# EAGLE design Platypus_v2_0_Proto_v1_0 (EAGLE 7.5.0)
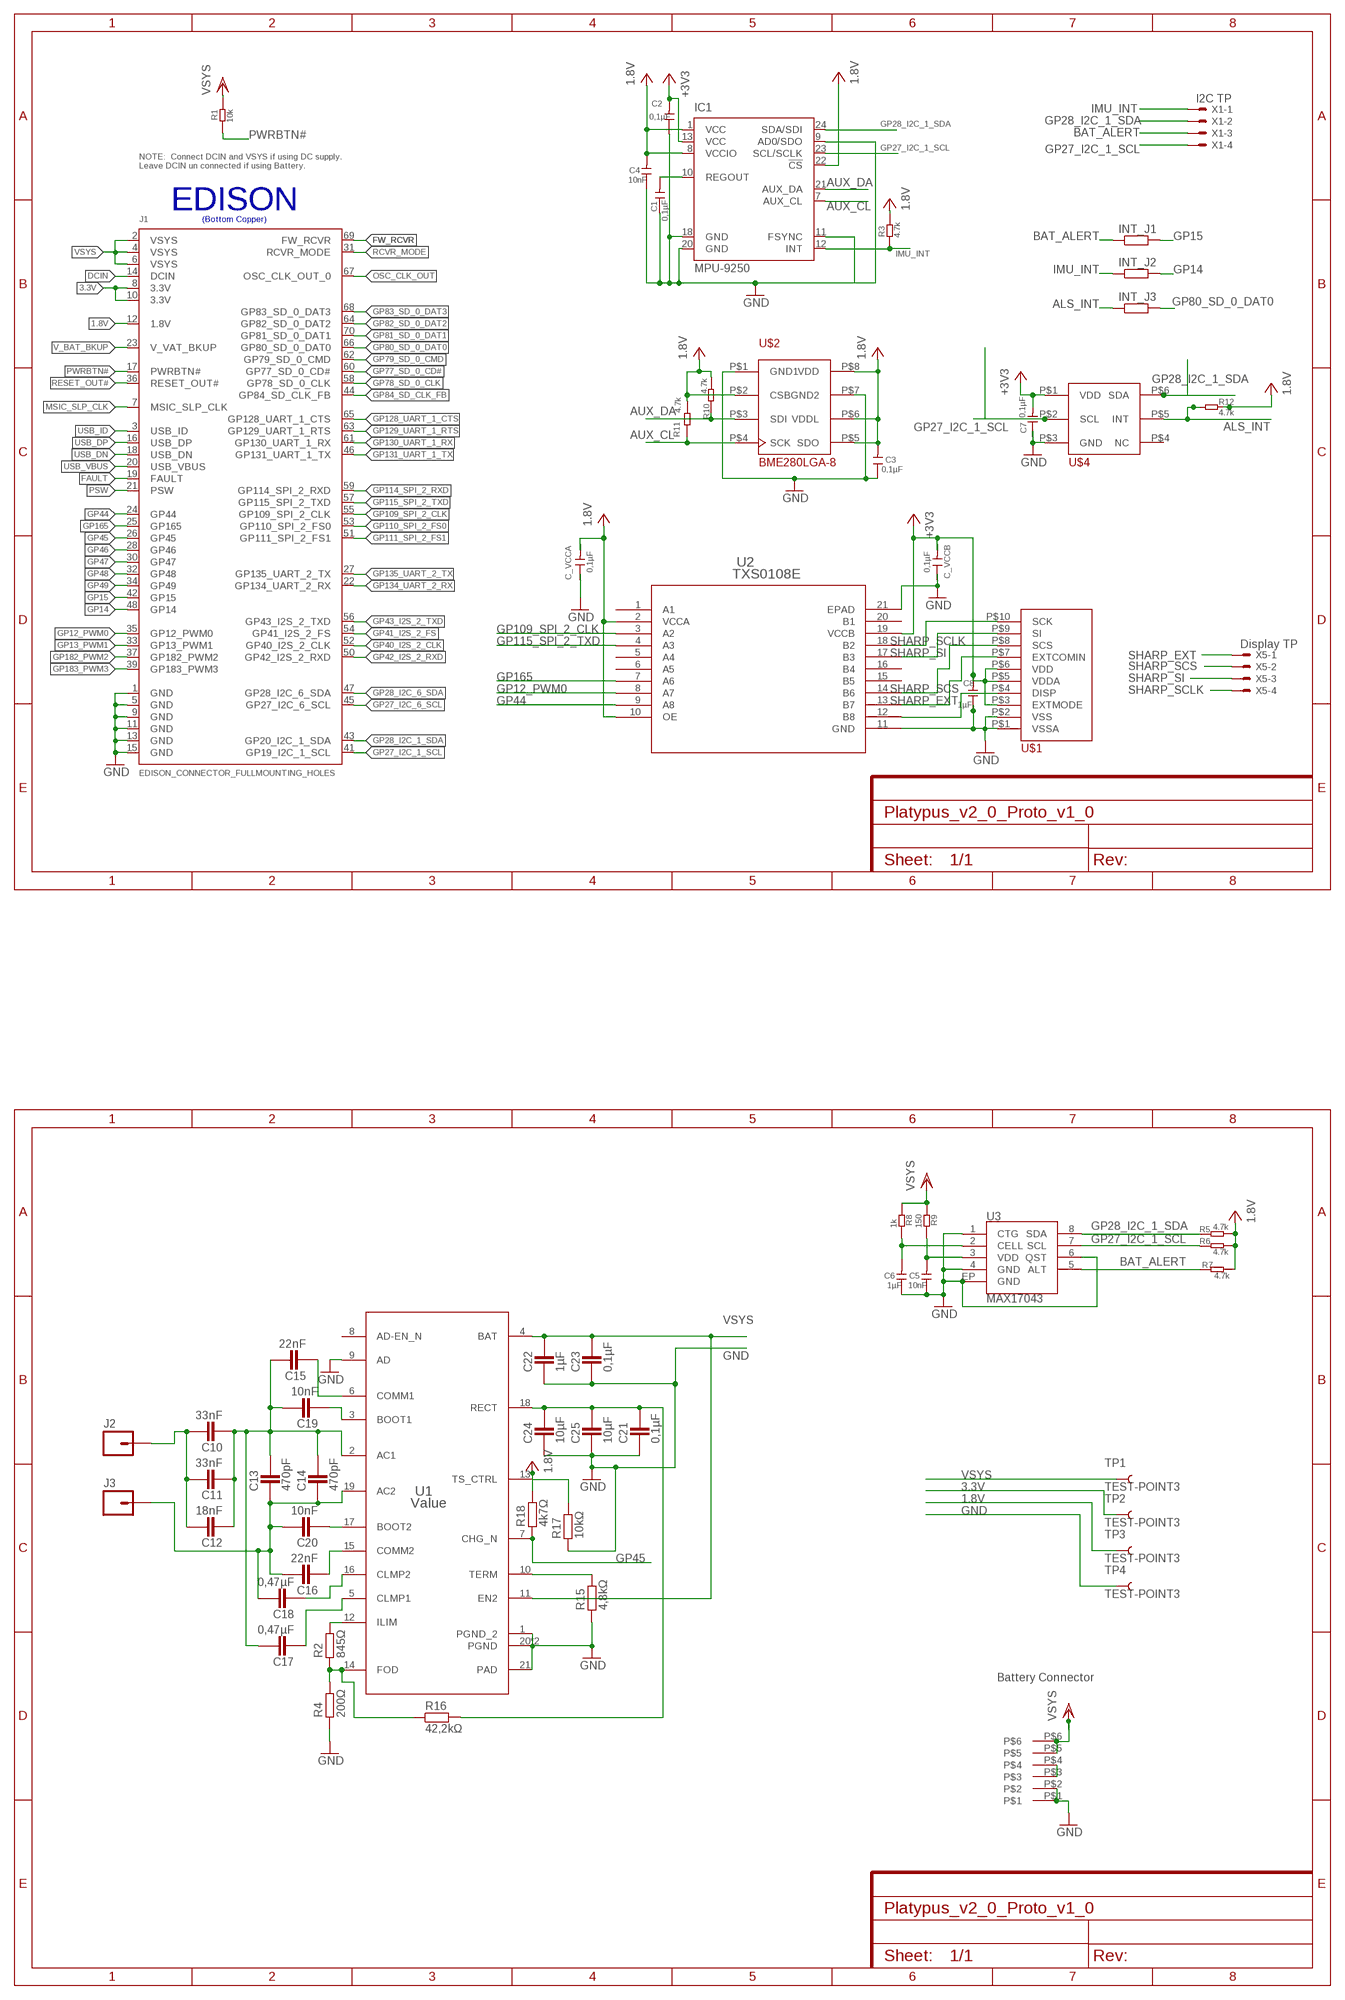
[diagram p0: schematic, sheet 1]

## Parts
C1  0,1µF  C-0603  [C0603]
C2  0,1µF  C-0603  [C0603]
C3  0,1µF  C-0603  [C0603]
C4  10nF  C-0603  [C0603]
C5  10nF  C-0603  [C0603]
C6  1µF  C-0603  [C0603]
C7  0,1µF  C-0603  [C0603]
C8  1µF  C-0603  [C0603]
C10  33nF  CAPACITOR_0402  [CAPC1005X60N]
C11  33nF  CAPACITOR_0402  [CAPC1005X60N]
C12  18nF  CAPACITOR_0402  [CAPC1005X60N]
C13  470pF  CAPACITOR_0402  [CAPC1005X60N]
C14  470pF  CAPACITOR_0402  [CAPC1005X60N]
C15  22nF  CAPACITOR_0402  [CAPC1005X60N]
C16  22nF  CAPACITOR_0402  [CAPC1005X60N]
C17  0,47µF  CAPACITOR_0402  [CAPC1005X60N]
C18  0,47µF  CAPACITOR_0402  [CAPC1005X60N]
C19  10nF  CAPACITOR_0402  [CAPC1005X60N]
C20  10nF  CAPACITOR_0402  [CAPC1005X60N]
C21  0,1µF  CAPACITOR_0402  [CAPC1005X60N]
C22  1µF  CAPACITOR_0402  [CAPC1005X60N]
C23  0,1µF  CAPACITOR_0402  [CAPC1005X60N]
C24  10µF  CAPACITOR_0603  [CAPC1608X92N]
C25  10µF  CAPACITOR_0603  [CAPC1608X92N]
C_VCCA  0,1µF  C-0603  [C0603]
C_VCCB  0,1µF  C-0603  [C0603]
IC1  MPU-9250  [QFN24-SMALL]
INT_J1  R-EU_R0201  [R0201]
INT_J2  R-EU_R0201  [R0201]
INT_J3  R-EU_R0201  [R0201]
J1  EDISON_CONNECTOR_FULLMOUNTING_HOLES  [EDISON_DAUGHTER]
J2  M01NOSILK-KIT  [1X01NS-KIT]
J3  M01NOSILK-KIT  [1X01NS-KIT]
R1  10k  R-0603  [R0603]
R2  845Ω  RESISTOR_0402  [RESC1005X40AN]
R3  4.7k  R-0603  [R0603]
R4  200Ω  RESISTOR_0402  [RESC1005X40AN]
R5  4.7k  R-0603  [R0603]
R6  4.7k  R-0603  [R0603]
R7  4.7k  R-0603  [R0603]
R8  1k  R-0603  [R0603]
R9  150  R-0603  [R0603]
R10  4.7k  R-0603  [R0603]
R11  4.7k  R-0603  [R0603]
R12  4.7k  R-0603  [R0603]
R15  4,8kΩ  RESISTOR_0402  [RESC1005X40AN]
R16  42,2kΩ  RESISTOR_0402  [RESC1005X40AN]
R17  10kΩ  RESISTOR_0402  [RESC1005X40AN]
R18  4k7Ω  RESISTOR_0402  [RESC1005X40AN]
TP1  TEST-POINT3  [PAD.03X.03]
TP2  TEST-POINT3  [PAD.03X.03]
TP3  TEST-POINT3  [PAD.03X.03]
TP4  TEST-POINT3  [PAD.03X.03]
U1  Value  BQ51050BRHLR  [RHL0020A]
U2  TXS0108E  TXS0108E_RGY_20  [RGY20_3P05X2P05]
U3  MAX17043  MAX1704X  [TDFN-8]
U$1  FH34SRJ-10S-0.5SH(50)FRC-10PIN-0.5MM  [FRC-10PIN-0.5MM]
U$2  BME280LGA-8  [LGA-8]
U$3  HIROSE_BAT_CON  [0.5MM-PITCH,6-PIN]
U$4  TSL25723FNFN-6PIN  [FN-6PIN]
X1  I2C TP  53047-04  [53047-04]
X5  Display TP  53047-04  [53047-04]

## Nets
1.8V: C3.2 C4.2 C_VCCA.2 IC1.1(VCC) IC1.8(VCCIO) IC1.22(!CS) J1.12(1.8V) R3.2 R5.2 R6.2 R7.1 R10.2 R11.2 R12.2 R18.2 TP3.P$1 U2.2(VCCA) U2.10(OE) U$2.P$2(CSB) U$2.P$5(SDO) U$2.P$6(VDDL) U$2.P$8(VDD)
3.3V: C2.2 C7.2 IC1.13(VCC) J1.8(3.3V) J1.10(3.3V) TP2.P$1 U$4.P$1(VDD) ; supply symbol labelled +3V3
+3V3: C8.2 C_VCCB.2 U2.19(VCCB) U$1.P$3(EXTMODE) U$1.P$5(VDDA) U$1.P$6(VDD)
ALS_INT: INT_J3.1 R12.1 U$4.P$5(INT)
AUX_CL: IC1.7(AUX_CL) R11.1 U$2.P$4(SCK)
AUX_DA: IC1.21(AUX_DA) R10.1 U$2.P$3(SDI)
BAT_ALERT: INT_J1.1 R7.2 U3.5(ALT) X1.3
DCIN: J1.14(DCIN)
FAULT: J1.19(FAULT)
FW_RCVR: J1.69(FW_RCVR)
GND: C1.1 C2.1 C3.1 C4.1 C5.1 C6.1 C7.1 C8.1 C21.1 C22.1 C23.1 C24.1 C25.1 C_VCCA.1 C_VCCB.1 IC1.9(AD0/SDO) IC1.11(FSYNC) IC1.18(GND) IC1.20(GND) J1.1(GND) J1.5(GND) J1.9(GND) J1.11(GND) J1.13(GND) J1.15(GND) R4.1 R15.1 R17.1 TP4.P$1 U1.1(PGND_2) U1.9(AD) U1.20(PGND) U1.21(PAD) U1.P$1(PGND) U2.11(GND) U2.21(EPAD) U3.1(CTG) U3.4(GND) U3.6(QST) U3.EP(GND) U$1.P$1(VSSA) U$1.P$2(VSS) U$2.P$1(GND1) U$2.P$7(GND2) U$3.P$1 U$3.P$2 U$4.P$3(GND)
GP12_PWM0: J1.35(GP12_PWM0) U2.8(A7)
GP13_PWM1: J1.33(GP13_PWM1)
GP14: INT_J2.2 J1.48(GP14)
GP15: INT_J1.2 J1.42(GP15)
GP27_I2C_1_SCL: IC1.23(SCL/SCLK) J1.41(GP19_I2C_1_SCL) R6.1 U3.7(SCL) U$4.P$2(SCL) X1.4
GP27_I2C_6_SCL: J1.45(GP27_I2C_6_SCL)
GP28_I2C_1_SDA: IC1.24(SDA/SDI) J1.43(GP20_I2C_1_SDA) R5.1 U3.8(SDA) U$4.P$6(SDA) X1.2
GP28_I2C_6_SDA: J1.47(GP28_I2C_6_SDA)
GP40_I2S_2_CLK: J1.52(GP40_I2S_2_CLK)
GP41_I2S_2_FS: J1.54(GP41_I2S_2_FS)
GP42_I2S_2_RXD: J1.50(GP42_I2S_2_RXD)
GP43_I2S_2_TXD: J1.56(GP43_I2S_2_TXD)
GP44: J1.24(GP44) U2.9(A8)
GP45: J1.26(GP45) R18.1 U1.7(CHG_N)
GP46: J1.28(GP46)
GP47: J1.30(GP47)
GP48: J1.32(GP48)
GP49: J1.34(GP49)
GP77_SD_0_CD#: J1.60(GP77_SD_0_CD#)
GP78_SD_0_CLK: J1.58(GP78_SD_0_CLK)
GP79_SD_0_CMD: J1.62(GP79_SD_0_CMD)
GP80_SD_0_DAT0: INT_J3.2 J1.66(GP80_SD_0_DAT0)
GP81_SD_0_DAT1: J1.70(GP81_SD_0_DAT1)
GP82_SD_0_DAT2: J1.64(GP82_SD_0_DAT2)
GP83_SD_0_DAT3: J1.68(GP83_SD_0_DAT3)
GP84_SD_CLK_FB: J1.44(GP84_SD_CLK_FB)
GP109_SPI_2_CLK: J1.55(GP109_SPI_2_CLK) U2.3(A2)
GP110_SPI_2_FS0: J1.53(GP110_SPI_2_FS0)
GP111_SPI_2_FS1: J1.51(GP111_SPI_2_FS1)
GP114_SPI_2_RXD: J1.59(GP114_SPI_2_RXD)
GP115_SPI_2_TXD: J1.57(GP115_SPI_2_TXD) U2.4(A3)
GP128_UART_1_CTS: J1.65(GP128_UART_1_CTS)
GP129_UART_1_RTS: J1.63(GP129_UART_1_RTS)
GP130_UART_1_RX: J1.61(GP130_UART_1_RX)
GP131_UART_1_TX: J1.46(GP131_UART_1_TX)
GP134_UART_2_RX: J1.22(GP134_UART_2_RX)
GP135_UART_2_TX: J1.27(GP135_UART_2_TX)
GP165: J1.25(GP165) U2.7(A6)
GP182_PWM2: J1.37(GP182_PWM2)
GP183_PWM3: J1.39(GP183_PWM3)
IMU_INT: IC1.12(INT) INT_J2.1 R3.1 X1.1
MSIC_SLP_CLK: J1.7(MSIC_SLP_CLK)
N$2: U2.12(B8) U$1.P$4(DISP)
N$5: C1.2 IC1.10(REGOUT)
N$6: C6.2 R8.1 U3.2(CELL)
N$8: C10.2 C11.2 C12.2 J2.1
N$9: U$3.P$3 U$3.P$4
N$13: C5.2 R9.1 U3.3(VDD)
N$14: C10.1 C11.1 C12.1 C13.2 C14.2 C15.2 C17.2 C19.2 U1.2(AC1)
N$15: C13.1 C14.1 C16.2 C18.2 C20.2 J3.1 U1.19(AC2)
N$16: C15.1 U1.6(COMM1)
N$17: C16.1 U1.15(COMM2)
N$18: C17.1 U1.5(CLMP1)
N$19: C18.1 U1.16(CLMP2)
N$20: C19.1 U1.3(BOOT1)
N$21: C20.1 U1.17(BOOT2)
N$22: C21.2 C24.2 C25.2 R16.2 U1.18(RECT)
N$25: R2.2 U1.12(ILIM)
N$26: R2.1 R4.2 R16.1 U1.14(FOD)
N$27: R15.2 U1.10(TERM)
N$28: R17.2 U1.13(TS_CTRL)
OSC_CLK_OUT: J1.67(OSC_CLK_OUT_0)
PSW: J1.21(PSW)
PWRBTN#: J1.17(PWRBTN#) R1.1
RCVR_MODE: J1.31(RCVR_MODE)
RESET_OUT#: J1.36(RESET_OUT#)
SHARP_EXT: U2.13(B7) U$1.P$7(EXTCOMIN) X5.1
SHARP_SCLK: U2.18(B2) U$1.P$10(SCK) X5.4
SHARP_SCS: U2.14(B6) U$1.P$8(SCS) X5.2
SHARP_SI: U2.17(B3) U$1.P$9(SI) X5.3
USB_DN: J1.18(USB_DN)
USB_DP: J1.16(USB_DP)
USB_ID: J1.3(USB_ID)
USB_VBUS: J1.20(USB_VBUS)
V_BAT_BKUP: J1.23(V_VAT_BKUP)
VSYS: C22.2 C23.2 J1.2(VSYS) J1.4(VSYS) J1.6(VSYS) R1.2 R8.2 R9.2 TP1.P$1 U1.4(BAT) U1.11(EN2) U$3.P$5 U$3.P$6
Unconnected: U1.8(AD-EN_N) U2.1(A1) U2.5(A4) U2.6(A5) U2.15(B5) U2.16(B4) U2.20(B1) U$4.P$4(NC)

## Notes on the sheet
- NOTE:  Connect DCIN and VSYS if using DC supply.
  Leave DCIN un connected if using Battery.
- EDISON
- (Bottom Copper)
- Battery Connector

## Library data of the parts
C1-C8 C_VCCA C_VCCB = Discrete:C*: Ceramic Capacitors
C10-C25 = ipc-7351-capacitor:CAPACITOR_
IC1 = invensense:MPU-9250: 9-axis MotionTracking device communicate with I2C/SPI Source: http://www.invensense.com/mems/gyro/documents/PS-MPU-9250A-01.pdf
INT_J1-INT_J3 = resistor:R-EU_: RESISTOR, European symbol
J1 = Edison:EDISON_CONNECTOR_FULL
J2 J3 = SparkFun-Connectors:M01: Header 1 Standard 1-pin 0.1" header. Use with straight break away headers (SKU : PRT-00116), right angle break away headers (PRT-00553), swiss pins (PRT-00743), machine pins (PRT-00117), and female headers (PRT-00115). SMTSO-256-ET is a "flush mount" nut for a 4-40 screw. The older package used to be too tight, and did not allow it to sit properly thru the drill hit. The latest (0.165DIA) fits nice and snug.
R1 R3 R5-R12 = Discrete:R*
R2 R4 R15-R18 = ipc-7351-resistor:RESISTOR_
TP1-TP4 = SparkFun-Passives:TEST-POINT: Bare copper test points for troubleshooting or ICT
U1 = BQ51050:BQ51050BRHLR; COMPTYPE: IC; MANUFACTURER: Texas Instruments; MOUNTTYPE: SMT; PACKAGEREFERENCE: RHL0020A; PARTNUMBER: BQ51050BRHLR; PIN_COUNT: 21; REFDES: RefDes; ROHS: Y; TYPE: TYPE
U2 = TXS0108E_VQFN:TXS0108E_RGY_20; DATASHEETURL: http://www.ti.com/lit/gpn/TXS0108E; DESCRIPTION: 8-Bit Bidirectional Voltage-Level Translator For Open-Drain And Push-Pull Application; FAMILY_NAME: AUTO DIRECTION SENSING DUAL SUPPLY TRANSLATOR; GENERIC_PART_NUMBER: TXS0108E; INDUSTRY_STD_PKG_TYPE: VQFN; MANUFACTURER: Texas Instruments; MANUFACTURER_PART_NUMBER: txs0108e_rgy_20; PACKAGE_DESIGNATOR: RGY; PIN_COUNT: 20; VENDOR: Texas Instruments
U3 = SparkFun-PowerIC:MAX1704X: MAX17043/MAX17044: Battery Fuel Guage (43 is 1cell, 44 is 2cell); PROD-ID: IC-10399
U$1 = SHARP_DISP_CON:FH34SRJ-10S-0.5SH(50)
U$2 = BME280:BME280
U$3 = Hirose_Bat_Con:HIROSE_BAT_CON
U$4 = TSL25723FN:TSL25723FN
X1 X5 = con-molex:53?-04: CONNECTOR wire to board 1.25 mm (.049 inch) pitch header; MF: WALDOM/MOLEX; MPN: 53047-0410; OC_FARNELL: 9733060; OC_NEWARK: 38C9900

## Board
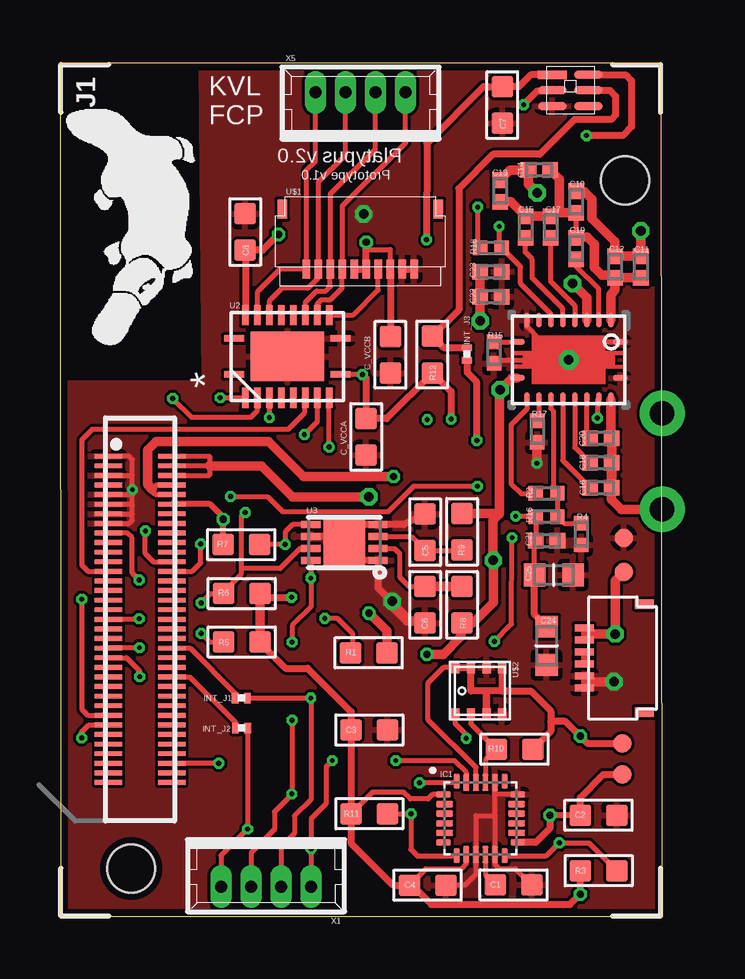
[diagram p1: board, top side]
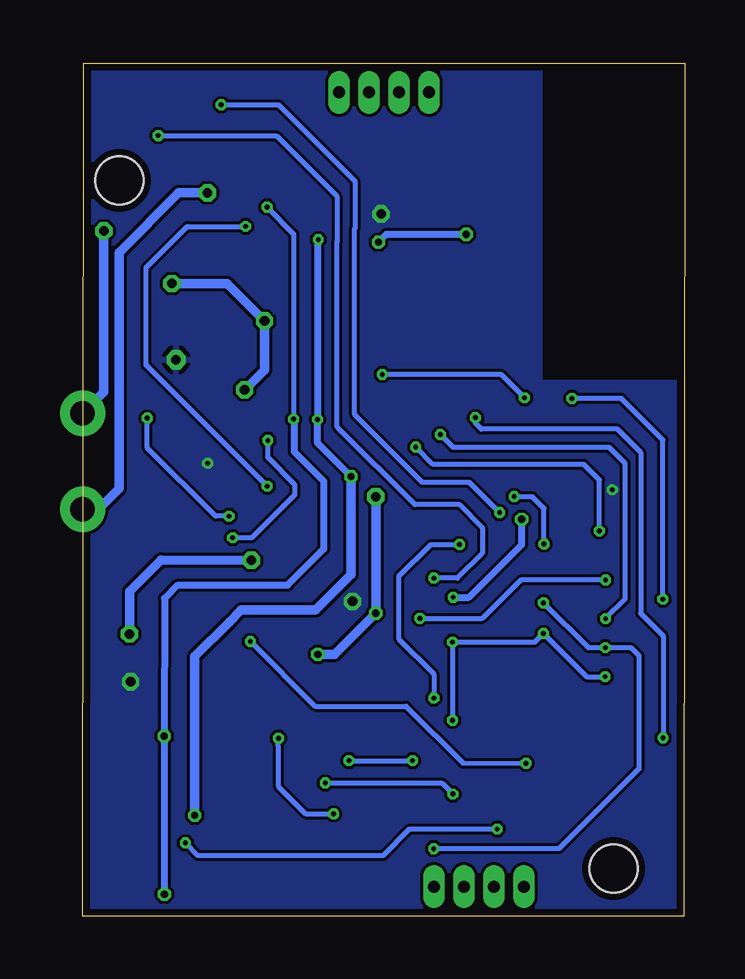
[diagram p2: board, bottom side, seen from below]

Size 25.11 x 35.56 mm. Coordinates in mm from the lower left corner, seen from the top.
Outline: 0.04,0 25.11,0 25.07,35.56 0,35.56 0.04,0
Copper layers (1*16): Top 0.035mm / dielectric 1.5mm / Bottom 0.035mm
Design rules "PCB-POOL HighSpec": minimum track width 0.125mm, minimum drill 0.2mm, track to track 0.125mm, track to pad 0.125mm, pad to pad 0.125mm, via to via 0.125mm, smd to smd 0.125mm, copper to edge 0.3mm, drill to drill 0.2mm, minimum pad ring 0.2mm, minimum via ring 0.125mm, stop-mask expansion 0.075mm, vias tented up to drill 0mil, thermal gap 0.2mm

### Footprints (pad centres in the part's own frame; a part is rotated, then mirrored left to right if it is on the bottom)
C0603 = smd 0.889 x 0.889: 1 -0.762,0; 2 0.762,0
CAPC1005X60N = smd 0.65 x 0.65: 1 -0.45,0; 2 0.45,0
CAPC1608X92N = smd 0.9 x 0.95: 1 -0.8,0; 2 0.8,0
QFN24-SMALL = smd 0.6 x 0.25: 1 -1.55,1; 6 -1.55,-1; 13 1.55,-1; 18 1.55,1 | smd 0.7 x 0.25: 2 -1.5,0.6; 3 -1.5,0.2; 4 -1.5,-0.2; 5 -1.5,-0.6; 14 1.5,-0.6; 15 1.5,-0.2; 16 1.5,0.2; 17 1.5,0.6 | smd 0.25 x 0.6: 7 -1,-1.55; 12 1,-1.55; 19 1,1.55; 24 -1,1.55 | smd 0.25 x 0.7: 8 -0.6,-1.5; 9 -0.2,-1.5; 10 0.2,-1.5; 11 0.6,-1.5; 20 0.6,1.5; 21 0.2,1.5; 22 -0.2,1.5; 23 -0.6,1.5
R0201 = smd 0.28 x 0.43: 1 -0.255,0; 2 0.255,0
EDISON_DAUGHTER = smd 1.14 x 0.2: 1 1.98,19.17; 2 4.62,19.17; 3 1.98,18.77; 4 4.62,18.77; 5 1.98,18.37; 6 4.62,18.37; 7 1.98,17.97; 8 4.62,17.97; 9 1.98,17.57; 10 4.62,17.57; 11 1.98,17.17; 12 4.62,17.17; 13 1.98,16.77; 14 4.62,16.77; 15 1.98,16.37; 16 4.62,16.37; 17 1.98,15.97; 18 4.62,15.97; 19 1.98,15.57; 20 4.62,15.57; 21 1.98,15.17; 22 4.62,15.17; 23 1.98,14.77; 24 4.62,14.77; 25 1.98,14.37; 26 4.62,14.37; 27 1.98,13.97; 28 4.62,13.97; 29 1.98,13.57; 30 4.62,13.57; 31 1.98,13.17; 32 4.62,13.17; 33 1.98,12.77; 34 4.62,12.77; 35 1.98,12.37; 36 4.62,12.37; 37 1.98,11.97; 38 4.62,11.97; 39 1.98,11.57; 40 4.62,11.57; 41 1.98,11.17; 42 4.62,11.17; 43 1.98,10.77; 44 4.62,10.77; 45 1.98,10.37; 46 4.62,10.37; 47 1.98,9.97; 48 4.62,9.97; 49 1.98,9.57; 50 4.62,9.57; 51 1.98,9.17; 52 4.62,9.17; 53 1.98,8.77; 54 4.62,8.77; 55 1.98,8.37; 56 4.62,8.37; 57 1.98,7.97; 58 4.62,7.97; 59 1.98,7.57; 60 4.62,7.57; 61 1.98,7.17; 62 4.62,7.17; 63 1.98,6.77; 64 4.62,6.77; 65 1.98,6.37; 66 4.62,6.37; 67 1.98,5.97; 68 4.62,5.97; 69 1.98,5.57; 70 4.62,5.57 | hole 2: 23.53,30.67; 2.93,1.98
1X01NS-KIT = drill 1.016 pad 1.88: 1 0,0
R0603 = smd 0.889 x 0.889: 1 -0.762,0; 2 0.762,0
RESC1005X40AN = smd 0.6 x 0.6: 1 -0.45,0; 2 0.45,0
PAD.03X.03 = smd 0.762 x 0.762: P$1 0,0
RHL0020A = smd 0.229 x 0.61: 1 -0.75,2.15; 10 -0.75,-2.15; 11 0.75,-2.15; 20 0.75,2.15 | smd 0.61 x 0.229: 2 -1.65,1.75; 3 -1.65,1.25; 4 -1.65,0.75; 5 -1.65,0.25; 6 -1.65,-0.25; 7 -1.65,-0.75; 8 -1.65,-1.25; 9 -1.65,-1.75; 12 1.65,-1.75; 13 1.65,-1.25; 14 1.65,-0.75; 15 1.65,-0.25; 16 1.65,0.25; 17 1.65,0.75; 18 1.65,1.25; 19 1.65,1.75 | smd 0.305 x 0.305: 21 0,0 | drill 0.4 octagon: P$1 0,0
RGY20_3P05X2P05 = smd 0.279 x 0.838: 1 -0.75,2.225; 10 -0.75,-2.225; 11 0.75,-2.225; 20 0.75,2.225 | smd 0.838 x 0.279: 2 -1.725,1.75; 3 -1.725,1.25; 4 -1.725,0.75; 5 -1.725,0.25; 6 -1.725,-0.25; 7 -1.725,-0.75; 8 -1.725,-1.25; 9 -1.725,-1.75; 12 1.725,-1.75; 13 1.725,-1.25; 14 1.725,-0.75; 15 1.725,-0.25; 16 1.725,0.25; 17 1.725,0.75; 18 1.725,1.25; 19 1.725,1.75 | smd 2.057 x 3.048: 21 0,0
TDFN-8 = smd 0.8 x 0.3: 1 -1.4,0.75; 2 -1.4,0.25; 3 -1.4,-0.25; 4 -1.4,-0.75; 5 1.4,-0.75; 6 1.4,-0.25; 7 1.4,0.25; 8 1.4,0.75 | smd 1.73 x 1.88: EP 0,0
FRC-10PIN-0.5MM = smd 0.3 x 0.8: P$1 0,0; P$2 0.5,0; P$3 1,0; P$4 1.5,0; P$5 2,0; P$6 2.5,0; P$7 3,0; P$8 3.5,0; P$9 4,0; P$10 4.5,0 | smd 0.4 x 0.8: P$11 -1,-2.5; P$12 5.5,-2.5
LGA-8 = smd 0.5 x 0.35: P$1 0.975,0.975; P$2 0.975,0.325; P$3 0.975,-0.325; P$4 0.975,-0.975; P$5 -0.975,-0.975; P$6 -0.975,-0.325; P$7 -0.975,0.325; P$8 -0.975,0.975
0.5MM-PITCH,6-PIN = smd 0.3 x 0.8: P$1 0,0; P$2 0.5,0; P$3 1,0; P$4 1.5,0; P$5 2,0; P$6 2.5,0 | smd 0.4 x 0.8: P$7 -1,-2.5; P$8 3.5,-2.5
FN-6PIN = smd 1.2 x 0.35: P$1 0,0; P$2 0,-0.65; P$3 0,-1.3; P$4 1.5,-1.3; P$5 1.5,-0.65; P$6 1.5,0
53047-04 = drill 0.5 pad 0.698 long: 1 1.875,0.45; 2 0.625,0.45; 3 -0.625,0.45; 4 -1.875,0.45

### Placement (x,y rotation side)
C1  18.91,1.3 180 top
C2  22.45,4.21 180 top
C3  12.9,7.76 180 top
C4  15.33,1.29 180 top
C5  15.22,16.01 270 top
C6  15.22,12.98 90 top
C7  18.44,33.81 90 top
C8  7.72,28.52 270 top
C10  21.52,29.77 90 top
C11  24.22,27.06 90 top
C12  23.14,27.06 90 top
C13  18.35,30.23 270 top
C14  19.98,31.1 0 top
C15  19.41,28.72 90 top
C16  22.55,17.86 0 top
C17  20.46,28.72 90 top
C18  22.55,18.89 0 top
C19  21.52,27.83 90 top
C20  22.55,19.92 0 top
C21  20.29,15.65 180 top
C22  17.97,25.82 180 top
C23  17.97,26.86 180 top
C24  20.29,11.27 90 top
C25  20.59,14.22 180 top
C_VCCA  12.77,19.98 90 top
C_VCCB  13.78,23.4 90 top
IC1  17.54,4.07 0 top
INT_J1  7.56,9.09 180 top
INT_J2  7.57,7.84 180 top
INT_J3  16.97,23.43 270 top
J1  0.04,0 0 top
J2  25.11,20.96 0 top
J3  25.11,16.96 0 top
R1  12.87,10.98 0 top
R2  20.29,17.62 180 top
R3  22.46,1.89 180 top
R4  21.73,15.92 90 top
R5  7.58,11.42 0 top
R6  7.58,13.45 0 top
R7  7.56,15.49 0 top
R8  16.77,12.98 270 top
R9  16.77,16.02 90 top
R10  18.95,6.96 0 top
R11  12.9,4.27 180 top
R12  15.53,23.41 270 top
R15  18.1,23.49 90 top
R16  20.29,16.65 180 top
R17  19.9,20.2 90 top
R18  17.97,27.85 180 top
TP1  23.51,14.35 0 top
TP2  23.45,5.9 0 top
TP3  23.44,7.21 0 top
TP4  23.51,15.77 0 top
U1  21.21,23.19 270 top
U2  9.48,23.33 90 top
U3  11.86,15.57 180 top
U$1  14.77,26.97 180 top
U$2  17.46,9.39 270 top
U$3  21.86,9.51 90 top
U$4  20.53,35.07 0 top
X1  8.59,1.68 180 top
X5  12.53,33.89 0 top

### Tracks (layer width: path | path; a pad name or v marks a point on that pad's centre or on a via)
1.8V  (via drill 0.2, 0.3)
  Top 0.2: C4.2 15.26,1.98 16.75,1.98 16.94,2.17 IC1.8 | IC1.22 17.35,6.19 15.33,8.21 15.33,9.7 15.99,10.36 U$2.P$5 | IC1.1 15.54,5.07 15.35,4.88 14.61,4.88 14.33,5.16 13.03,5.16 R11.2 | U2.2 | v12.61,22.58 U2.10 | U2.10 | v6.68,21.61 U2.2 | R18.2 17.42,27.95 v17.42,29.56
  Top 0.24: 6.26,17.17 J1.12
  Top 0.25: R7.1 6.8,16.63
  Top 0.254: 6.26,17.17 6.8,16.63 v6.8,16.54
  Top 0.3: R3.2 v21.7,0.91 v21.69,0.91 21.27,0.49 15.48,0.49 14.63,1.34 C4.2 13.89,1.29 12.14,3.04 R11.2 C3.2 12.14,8.52 10.33,10.33 9.4,10.33 8.34,11.39 8.33,11.39 8.33,13.29 8.35,13.29 | 6.8,16.63 v6.8,16.54 | R6.2 8.35,13.29 | 8.34,11.37 R5.2 | 18.45,10.37 U$2.P$8 18.44,9.38 | U$2.P$5 U$2.P$6 17.14,9.38 17.78,9.38 | 8.34,11.41 R5.2 | 8.34,11.4 R5.2 | 8.35,13.29 v9.65,13.29 | R10.2 20.46,7.71 20.46,8.11 | 17.79,9.38 17.78,9.38 | 18.44,9.38 17.79,9.38 | 17.79,9.38 U$2.P$2 17.78,9.38 | 18.44,9.38 19.62,9.38 20.46,8.55 20.46,8.11 | v21.7,7.5 v21.7,7.49 | v21.7,7.49 21.08,8.11 20.46,8.11 | v12.61,22.58 12.77,22.42 C_VCCA.2 | C_VCCA.2 | v21.7,7.49 21.98,7.21 TP3.P$1 | v16.31,20.72 16.31,21.87 R12.2 13.62,20.74 C_VCCA.2
  Top 0.4: R6.2 R5.2 | R7.1
  Bottom 0.2: v12.61,22.58 7.65,22.58 v6.68,21.61 | v16.31,20.72 16.31,28.44 v17.42,29.55 v17.42,29.56
  Bottom 0.3: v21.7,0.91 21.7,4.89 v21.7,7.5 21.69,13.25 21.14,13.8 16.55,13.8 15.05,15.3 15.05,18.13 16.28,19.36 16.28,20.69 v16.31,20.72 | v9.65,13.29 9,13.29 R7.1 6.8,16.63 v6.8,16.54
3.3V  (via drill 0.2, 0.3)
  Top 0.2: J1.10 4.07,17.57 arc-90 3.85,17.79 4.03,17.97 J1.8
  Top 0.25: C2.2 21.68,4.2 v20.43,4.2
  Top 0.3: v20.43,4.2 20.43,3.66 19.84,3.07 IC1.13 | U$4.P$1 19.63,35.07 19.13,34.57 C7.2 17.66,34.58 15.3,32.21 v15.28,28.2 | v13.92,18.32 v13.91,18.32 | C2.2 21.69,4.94 22.65,5.9 TP2.P$1
  Top 0.4: 13.91,18.34 v13.91,18.32 10.16,18.32 8.69,19.79 4.02,19.79 3.65,19.42 3.65,17.99 3.85,17.79
  Bottom 0.254: 19.02,12.2 19.03,12.2 18.98,12.26
  Bottom 0.3: v15.28,28.2 15.3,28.2 v15.31,20.7 15.31,19.72 v13.91,18.32
  Bottom 0.4: v20.43,4.2 20.43,10.82 18.98,12.26 18.49,12.76 15.4,12.76 13.91,14.25 v13.91,18.32
+3V3  (via drill 0.3)
  Top 0.2: 12.77,27.77 12.77,27.79 13.77,27.79 U$1.P$3
  Top 0.3: U$1.P$6 U$1.P$5 12.77,27.77 v12.77,28.09 | v9.11,28.42 8.45,27.76 C8.2 7.73,27.75 U2.19 | U$1.P$3 C_VCCB.2
  Bottom 0.3: v12.77,28.09 12.44,28.42 v9.11,28.42
ALS_INT
  Top 0.3: U$4.P$5 22.93,34.42 23.16,34.19 23.16,33.39 22.98,33.21 21.45,33.21 20,31.76 18.06,31.76 16.63,30.33 16.63,25.27 R12.1 16.02,23.69 INT_J3.1
AUX_CL  (via drill 0.2)
  Top 0.2: IC1.7 14.9,2.51 14.63,2.78 v14.64,4.26 R11.1 | v16.94,7.41 16.94,7.55 16.48,8.01 U$2.P$4
  Bottom 0.2: v16.94,7.41 16.95,7.09 16.95,5.41 15.81,4.27 v14.65,4.27 v14.64,4.26
AUX_DA
  Top 0.2: U$2.P$3 17.14,8.01 R10.1 17.74,6.51 IC1.21
BAT_ALERT  (via drill 0.2)
  Top 0.2: R7.2 v9.39,15.49 9.39,16.01 9.7,16.32 U3.5 | v10.46,9.09 v10.47,9.09 | v10.46,9.09 10.46,4.85 9.78,4.17 9.78,3.46 9.21,2.89 9.21,1.16 X1.3 | INT_J1.1 v10.46,9.09
  Bottom 0.2: v9.39,15.49 10.59,15.49 11.93,14.15 11.93,11.56 10.46,10.09 v10.46,9.09
GND  (via drill 0.2, 0.4)
  Top 0.2: C4.1 16.89,1.29 17.34,1.74 IC1.9 17.34,4.18 18.14,4.18 | C1.1 18.99,1.98 18.31,1.98 18.14,2.15 IC1.11 18.14,4.18 | 18.14,4.18 18.14,5.06 | 18.14,5.06 IC1.20 | IC1.18 18.15,5.07 18.14,5.06 | J1.15 2.89,16.37 3.02,16.5 3.02,16.77 | 3.02,17.13 3.02,17.54 | 3.02,17.54 v3.02,17.77 3.02,18.38 | 3.02,18.38 3.02,19.04 2.89,19.17 J1.1 | J1.5 3.01,18.37 3.02,18.38 | J1.9 2.99,17.57 3.02,17.54 | J1.11 2.98,17.17 3.02,17.13 | J1.13 3.02,16.77 | 3.02,16.77 3.02,17.13 | U1.1 21.21,23.94 U1.P$1 | U1.9 | U1.9 19.46,24.57 19.97,24.06 20.34,24.06 20.82,23.58 | 20.82,23.58 U1.P$1 | R17.1 | 19.89,19 v19.89,18.88 | R15.1 18.25,23.19 20.37,23.19 20.76,23.58 20.82,23.58 | U1.P$1
  Top 0.3: 12.61,16.32 U3.4 14.34,16.32 C5.1 | 12.3,14.82 U3.1 13.26,13.68 14.59,12.36 15.32,12.36 | 11.61,15.82 U3.6 | 15.33,12.37 C6.1 | U$3.P$2 U$3.P$1 21.94,9.77 | U$1.P$1 | U$1.P$2 U$1.P$1 | U$1.P$1 | C_VCCA.1 12.76,19.21
  Top 0.4: 21.94,9.77 v23.1,9.77 | C6.1 15.13,12.31 14.46,12.31 13.85,12.92 v13.85,13.12 | R17.1 19.89,19
  Top 0.406: 12.61,16.32 arc90 U3.EP | 12.3,14.82 arc-90 12.25,14.87 12.25,15.18 arc90 U3.EP | U3.EP 11.61,15.82 | 15.32,12.36 C6.1
  Bottom 0.4: v13.85,13.12 13.77,13.2 13.77,13.28
  other vias: 12.66,29.27
  pour Bottom: 6.03,35.44 25.01,35.44 25.01,0.14 0.14,0.14 0.14,22.25 6.01,22.25 6.01,35.43
  pour Top: 5.88,35.54 24.99,35.52 25.01,0.14 0.14,0.14 0.14,22.25 6.01,22.25
GP12_PWM0  (via drill 0.2)
  Top 0.2: J1.35 3.27,12.37 v3.3,12.4 | v10.19,20.07 10.73,20.61 U2.8
  Bottom 0.2: v3.3,12.4 2.49,13.21 2.49,18.88 3.16,19.55 9.67,19.55 v10.19,20.07
GP14
  Top 0.2: INT_J2.2 7.32,8.07 5.41,9.97 J1.48
GP15
  Top 0.2: J1.42 5.42,11.17 7.31,9.29 INT_J1.2
GP27_I2C_1_SCL  (via drill 0.2)
  Top 0.2: U3.7 10.01,15.32 9.18,14.49 7.61,14.49 arc90 7.57,14.45 | 7.57,14.45 7.57,16.67 v7.72,16.82 | 7.57,14.45 7.57,14.27 6.82,13.52 R6.1 6.28,13.45 v5.89,13.06 | X1.4 10.47,1.16 v10.47,2.81 10.47,4.05 11.1,4.68 11.1,6.23 v11.35,6.48 | v14,6.48 16.45,6.48 16.94,5.99 IC1.23 | v3.31,11.19 3.29,11.17 J1.41
  Top 0.3: v19.33,33.82 19.91,34.4 20.53,34.4 U$4.P$2
  Bottom 0.2: v19.33,33.82 16.93,33.82 13.75,30.64 13.75,28.66 13.76,28.65 13.76,20.9 10.94,18.08 8.98,18.08 v7.72,16.82 | v10.47,2.81 5.24,2.81 1.9,6.15 1.9,10.85 2.22,11.17 3.29,11.17 v3.31,11.19 4.02,11.19 v5.89,13.06 | v14,6.48 v11.35,6.48
GP28_I2C_1_SDA  (via drill 0.2)
  Top 0.2: v5.89,11.78 6.25,11.42 R5.1 | U3.8 v10.46,14.09 10.46,12.89 9.68,12.11 v9.68,11.42 | v9.68,5.08 8.94,4.34 8.94,3.61 7.97,2.64 7.97,1.16 X1.2 | 3.34,9.97 v3.32,9.98 3.32,10.23 2.78,10.77 J1.43 | IC1.24 16.47,5.55 v14.99,5.55 | v9.68,8.16 v9.68,5.08 | v9.67,5.09 v9.68,5.08
  Top 0.3: U$4.P$6 23.59,35.07 23.83,34.83 23.83,32.9 23.47,32.54 v21.95,32.54
  Bottom 0.2: v9.68,8.16 v9.68,11.42 6.25,11.42 v5.89,11.78 4.09,9.98 v3.32,9.98 | v10.46,14.09 9.47,14.09 8.44,15.12 8.44,16.21 9.38,17.15 11.25,17.15 14.49,20.39 14.49,28.1 14.5,28.11 14.5,30.01 17.02,32.53 v21.96,32.53 v21.95,32.54 | v14.99,5.55 10.13,5.55 v9.67,5.09
GP44  (via drill 0.2)
  Top 0.2: J1.24 3.9,14.77 3.56,15.11 v3.56,16.06 | U2.9 11.22,21.59 v11.22,19.55
  Bottom 0.2: v3.56,16.06 3.56,18.18 4.21,18.83 10.49,18.83 v11.21,19.55 v11.22,19.55
GP45  (via drill 0.2)
  Top 0.2: v7.11,17.49 8.65,17.49 9.28,16.86 13.69,16.86 14.75,17.92 v17.41,17.92 | 20.46,25.09 U1.7 20.46,25.1 19.2,26.36 19.2,27.07 R18.1 18.31,27.85 v18.31,28.75 | J1.26 5.51,14.37 5.87,14.73 v5.87,15.51
  Bottom 0.2: v5.87,15.51 5.87,17 6.35,17.48 v7.1,17.48 v7.11,17.49 | v18.31,28.75 20.74,28.75 22.46,27.03 22.46,22.97 v17.41,17.92
GP80_SD_0_DAT0  (via drill 0.2)
  Top 0.2: v6.62,6.37 J1.66 | v18.11,11.45 18.83,12.17 v18.85,15.77
  Top 0.3: v17.38,19.83 17.38,22.26 16.98,22.66 INT_J3.2
  Bottom 0.2: v6.62,6.37 9.25,6.38 11.62,8.75 15.41,8.75 v18.11,11.45 | v17.38,19.83 17.38,19.11 16.26,17.99 16.26,17.56 18.05,15.77 v18.85,15.77
GP109_SPI_2_CLK  (via drill 0.2)
  Top 0.2: v0.91,13.21 0.91,8.62 1.16,8.37 J1.55 | 8.24,21.59 U2.3 8.23,21.07 7.96,20.8 5.48,20.8 v4.7,21.58
  Bottom 0.2: 0.91,13.15 v0.91,13.21 0.91,19.85 2.64,21.58 v4.7,21.58
GP115_SPI_2_TXD  (via drill 0.2)
  Top 0.2: v0.9,7.43 0.9,7.67 1.2,7.97 J1.57 | v8.73,20.78 U2.4 | U2.4
  Bottom 0.2: v0.9,7.43 0.9,11.68 1.84,12.62 1.84,19.33 2.81,20.3 8.48,20.3 8.48,20.31 8.73,20.56 v8.73,20.78
GP165
  Top 0.2: J1.25 1.17,14.37 0.91,14.63 0.91,19.85 1.36,20.3 9.49,20.3 9.5,20.29 10.21,21 10.21,21.59 U2.7
IMU_INT  (via drill 0.2)
  Top 0.2: R3.1 22.06,3.05 v20.82,3.05 20.29,2.52 IC1.12 | X1.1 6.72,2.53 v7.82,3.63 v7.83,3.63 INT_J2.1
  Bottom 0.2: v7.82,3.63 11.47,3.63 12.58,2.52 20.29,2.52 v20.82,3.05
N$2
  Top 0.2: U2.12 12.23,25.05 13.27,26.09 U$1.P$4
N$5
  Top 0.2: IC1.10 17.74,1.71 C1.2
N$6
  Top 0.2: U3.2 13.95,15.32 14.16,15.11 14.16,14.14 14.56,13.74 C6.2
  Top 0.4: C6.2 R8.1
N$8  (via drill 0.4)
  Top 0.2: 21.6,30.2 C10.2
  Top 0.4: 21.6,30.2 21.86,30.2 22.18,29.88 22.18,29.08 23.14,28.12 C12.2 C11.2 v24.22,28.56
  Bottom 0.4: J2.1 24.22,21.85 v24.22,28.56
N$9
  Top 0.3: U$3.P$4 U$3.P$3
N$13
  Top 0.2: U3.3 14.65,15.82 C5.2 16.76,15.25 R9.1
N$14
  Top 0.2: C10.1 21.48,29.2 21.58,29.1 21.52,29.04 C19.2 21.68,28.3 | C14.2 20.58,31 | 20.58,29.29 C17.2 arc90 20.58,29.29 | 20.58,29.29 20.61,29.32 | 23.02,26.73 C12.1
  Top 0.4: C17.2 C15.2 18.8,29.78 C13.2 | 20.61,29.32 C10.1 | U1.2 22.96,25.91 23.14,26.09 C12.1 C11.1 | 21.68,28.3 21.99,28.3 22.28,28.01 22.28,27.04 22.59,26.73 23.02,26.73 | 20.58,29.29 20.82,29.53 20.82,30.72 C14.2
N$15  (via drill 0.4)
  Top 0.2: 22.96,19.92 C20.2 22.96,19.96 | 23.18,18.89 C18.2
  Top 0.4: C16.2 C18.2 C20.2 | U1.19 22.96,19.96 | C18.2 22.99,17.37 23.4,16.96 J3.1 | C13.1 18.77,31.1 C14.1 19.53,30.52 v19.9,30.15
  Bottom 0.4: J3.1 24.45,16.96 23.59,17.82 23.59,27.66 21.1,30.15 v19.9,30.15
N$16
  Top 0.2: U1.6 20.96,25.32 19.69,26.59 19.69,27.38 19.4,27.67 C15.1
N$17
  Top 0.2: U1.15 20.96,19 C16.1
N$18
  Top 0.2: U1.5 21.46,25.46 20.46,26.46 C17.1 | U1.5
N$19
  Top 0.2: U1.16 21.46,19.53 C18.1
N$20
  Top 0.2: U1.3 22.46,26.14 21.52,27.08 C19.1
N$21
  Top 0.2: U1.17 21.96,20.2 arc90 22.26,19.9 22.26,19.92 C20.1
N$22  (via drill 0.2)
  Top 0.2: C25.2 19.79,15.6 C21.2 R16.2 arc90 19.82,16.67 v19,16.67 | U1.18 22.41,21.54 v22.41,20.76
  Top 0.3: C24.2 19.79,12.57 C25.2
  Bottom 0.2: v22.41,20.76 22.41,19.52 19.56,16.67 v19,16.67
N$25
  Top 0.2: U1.12 19.46,21.13 18.81,20.48 18.81,18.03 19.23,17.61 R2.2
N$26
  Top 0.2: U1.14 20.46,21.16 20.58,21.04 20.58,17.62 R2.1 R16.1 21.02,16.37 R4.2
N$27
  Top 0.2: R15.2 | R15.2 U1.10
N$28
  Top 0.2: U1.13 19.96,20.74 R17.2
PWRBTN#  (via drill 0.2)
  Top 0.2: R1.1 12.21,11.24 12.21,11.76 11.57,12.4 v11.05,12.4 v11.04,12.41 | J1.17 2.81,15.97 3,15.78 3,14.31 v3.3,14.01
  Bottom 0.2: v11.04,12.41 8.44,12.41 6.84,14.01 v3.3,14.01
SHARP_EXT
  Top 0.2: X5.1 14.41,32.23 11.77,29.59 U$1.P$7 11.77,26.18 11.29,25.7 10.9,25.7 10.73,25.53 U2.13
SHARP_SCLK
  Top 0.2: X5.4 10.65,34.4 10.65,31.47 10.27,31.09 U$1.P$10 9.18,26.97 8.22,26.01 8.22,25.06 U2.18
SHARP_SCS
  Top 0.2: X5.2 13.15,31.97 11.27,30.09 U$1.P$8 11.27,26.24 11.09,26.06 10.7,26.06 10.23,25.59 U2.14
SHARP_SI
  Top 0.2: X5.3 11.9,31.72 10.77,30.59 U$1.P$9 10.77,26.6 10.34,26.17 9.26,26.17 8.72,25.63 8.72,25.06 U2.17
VSYS  (via drill 0.3, 0.4)
  Top 0.2: 6.25,18.77 J1.4 | J1.2 6.23,19.17 6.23,18.79 6.23,18.37 J1.6 | U1.4
  Top 0.3: U$3.P$6 U$3.P$5 21.94,11.76
  Top 0.4: R1.2 13.63,11.88 v12.88,12.63 | 21.94,11.76 v23.15,11.76 23.15,13.99 TP1.P$1 | 6.23,18.79 6.25,18.77 8.4,18.77 9.69,17.48 v12.88,17.48 | C23.2 C22.2 v17.52,24.81 | v15.3,10.91 15.98,10.91 16.72,11.65 16.72,12.36 R8.2 17.22,12.22 18.07,13.07 v18.07,14.83 v18.06,14.84 18.06,16.5 18.32,16.76 18.32,16.9 | U1.11 18.85,22.44 v18.35,21.94 18.32,21.91 18.32,16.9 | R9.2 18.2,16.78 18.32,16.9 | v21.38,26.37 21.96,25.79 U1.4
  Bottom 0.4: v18.07,14.83 21.83,14.85 23.15,13.53 v23.15,11.76 | v21.38,26.37 19.08,26.37 v17.52,24.81 17.52,22.77 v18.35,21.94 | v15.3,10.91 14.6,10.91 v12.88,12.63 v12.88,17.48

### Text on the board
tDocu: TSL25723FN | SHARP_SCK | SHARP_SI | SHARP_SCS | SHARP_EXT | Ambient Light Sensor(ALS) | SHARP / Display / Connector | Antenna KOZ | J_ALS | BQ51050B | Level Shifter | Qi-Receiver | AC1 | AC2 | GND | Battery Gauge | VSYS | Power / Connector | VSYS | TEMP | J_BAT | GND | J_IMU | Pressure / Humidity / Temperature / Sensor | 1V8 | Intel Edison 70-pin Hirose Connector | 9DOF / IMU | 3V3 | IMU_INT | I2C_1_SDA | BAT_INT | I2C_1_SCL
tSilk: KVL / FCP | Platypus v2.0
_tsilk: Prototype v1.0